# EAGLE design dmxisolator-mod-v1a (EAGLE 9.1.2)
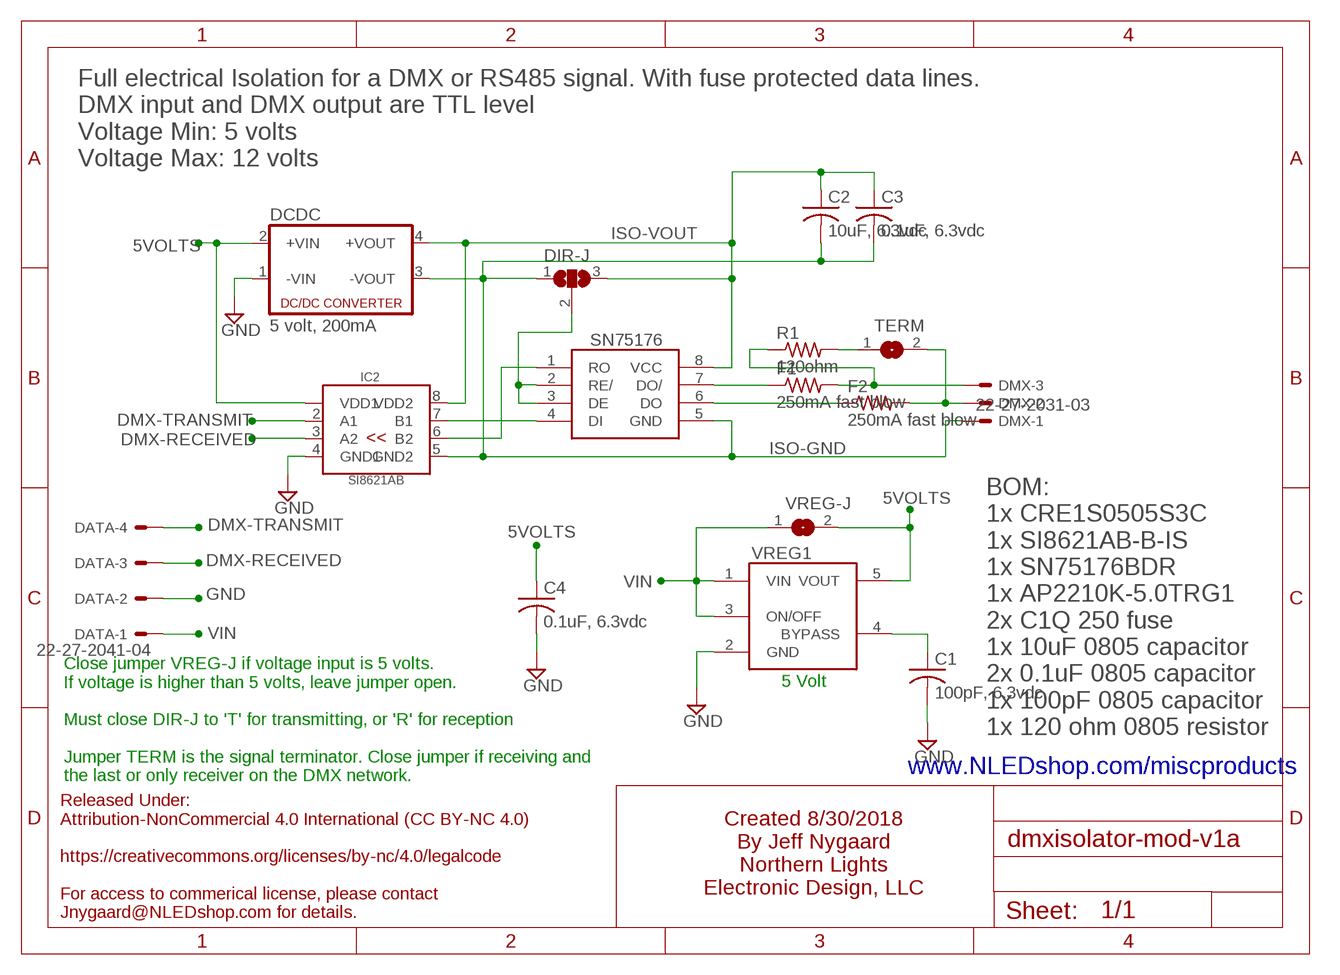
[diagram p0: schematic, sheet 1]

## Parts
C1  100pF, 6.3vdc  C-USC0805  [C0805]
C2  10uF, 6.3vdc  C-USC0805  [C0805]
C3  0.1uF, 6.3vdc  C-USC0805  [C0805]
C4  0.1uF, 6.3vdc  C-USC0805  [C0805]
DATA  22-27-2041-04  [6410-04]
DCDC  5 volt, 200mA  NME  [NME]
DIR-J  SJ2W  [SJ_2]
DMX  22-27-2031-03  [6410-03]
F1  250mA fast blow  R-US_R1206  [R1206]
F2  250mA fast blow  R-US_R1206  [R1206]
IC2  SI8621AB-B-IS  [SOIC-8]
R1  120ohm  R-US_R0805  [R0805]
SN75176  SN75176SMD  [SOIC-8]
TERM  SJ  [SJ]
VREG1  AP2210K  [SOT25]
VREG-J  SJ  [SJ]

## Nets
5VOLTS: C4.1 DCDC.2(+VIN) IC2.1(VDD1) VREG1.5(VOUT) VREG-J.2
BYPASS: C1.1 VREG1.4(BYPASS)
DMX-INV: DMX.3 F1.2 R1.1
DMX-POS: DMX.2 F2.2 TERM.2
DMX-RECEIVED: DATA.3 IC2.3(A2)
DMX-TRANSMIT: DATA.4 IC2.2(A1)
GND [ground]: C1.2 C4.2 DATA.2 DCDC.1(-VIN) IC2.4(GND1) VREG1.2(GND)
ISO-GND: C2.2 C3.2 DCDC.3(-VOUT) DIR-J.1 DMX.1 IC2.5(GND2) SN75176.5(GND)
ISO-VOUT: C2.1 C3.1 DCDC.4(+VOUT) DIR-J.3 IC2.8(VDD2) SN75176.8(VCC)
N$1: R1.2 TERM.1
N$2: F1.1 SN75176.7(DO/)
N$4: F2.1 SN75176.6(DO)
N$9: DIR-J.2 SN75176.2(RE/) SN75176.3(DE)
N$10: IC2.6(B2) SN75176.1(RO)
N$11: IC2.7(B1) SN75176.4(DI)
VIN: DATA.1 VREG1.1(VIN) VREG1.3(ON/OFF) VREG-J.1

## Notes on the sheet
- Full electrical Isolation for a DMX or RS485 signal. With fuse protected data lines.
  DMX input and DMX output are TTL level
  Voltage Min: 5 volts
  Voltage Max: 12 volts
- 5 Volt
- BOM:
  1x CRE1S0505S3C 
  1x SI8621AB-B-IS 
  1x SN75176BDR 
  1x AP2210K-5.0TRG1 
  2x C1Q 250 fuse
  1x 10uF 0805 capacitor
  2x 0.1uF 0805 capacitor
  1x 100pF 0805 capacitor
  1x 120 ohm 0805 resistor
- www.NLEDshop.com/miscproducts
- Close jumper VREG-J if voltage input is 5 volts.
  If voltage is higher than 5 volts, leave jumper open.
  
  Must close DIR-J to 'T' for transmitting, or 'R' for reception
  
  Jumper TERM is the signal terminator. Close jumper if receiving and
  the last or only receiver on the DMX network.
- Created 8/30/2018
  By Jeff Nygaard
  Northern Lights
  Electronic Design, LLC
- Released Under:
  Attribution-NonCommercial 4.0 International (CC BY-NC 4.0)
  
  https://creativecommons.org/licenses/by-nc/4.0/legalcode
  
  For access to commerical license, please contact
  Jnygaard@NLEDshop.com for details.

## Library data of the parts
C1-C4 = rcl:C-US: CAPACITOR, American symbol; SPICEPREFIX: C
DATA = con-molex:22-?-04: CONNECTOR wire to board 2.54 mm (.1 inch) pitch header; MF: MOLEX; OC_FARNELL: unknown; OC_NEWARK: unknown
DCDC = dc-dc-converter:NME: DC-DC CONVERTER; MF: C & D TECHNOLOGIES, INC; MPN: NME1205D; OC_FARNELL: 1021466; OC_NEWARK: 98B8198
DIR-J = jumper:SJ2W: SMD solder JUMPER
DMX = con-molex:22-?-03: CONNECTOR wire to board 2.54 mm (.1 inch) pitch header; MF: MOLEX; OC_FARNELL: unknown; OC_NEWARK: unknown
F1 F2 R1 = rcl:R-US_: RESISTOR, American symbol; SPICEPREFIX: R
IC2 = NLED-integratedcircuit:SI8621AB-B-IS
SN75176 = NLED-integratedcircuit:SN75176
TERM VREG-J = jumper:SJ: SMD solder JUMPER
VREG1 = NLED-integratedcircuit:AP2210K: AP2210K - Diodes Incorporated LDO Voltage Regulators 300mA CMOS LDO 5.0V 250mV

## Board
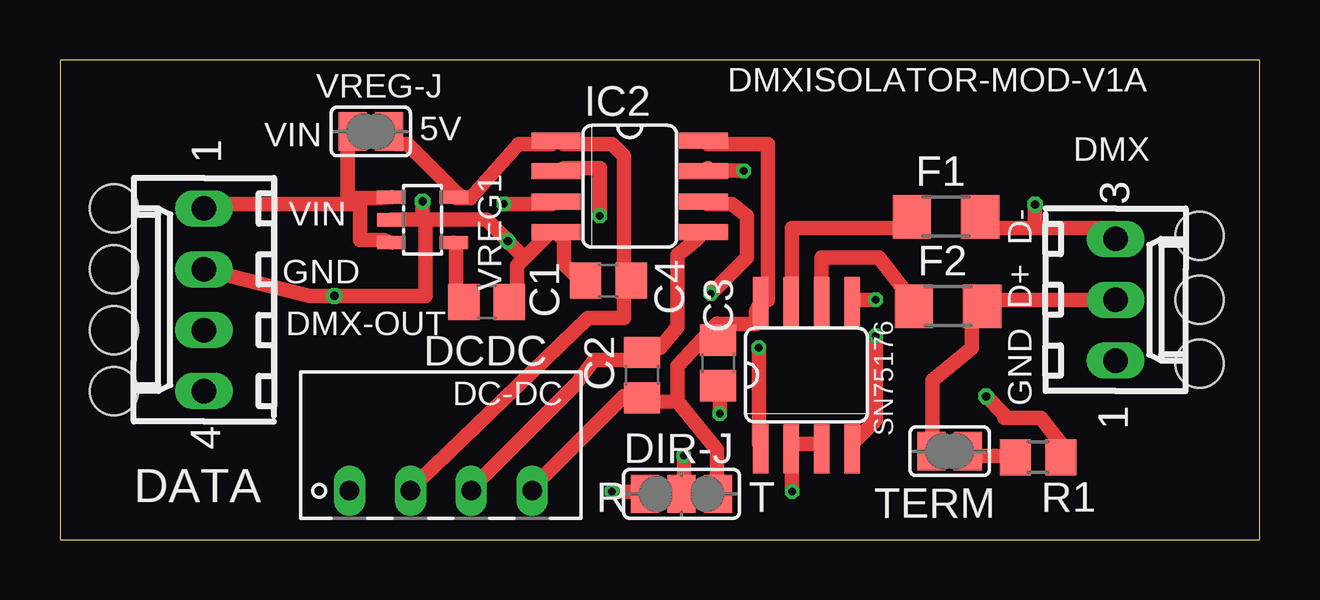
[diagram p1: board, top side]
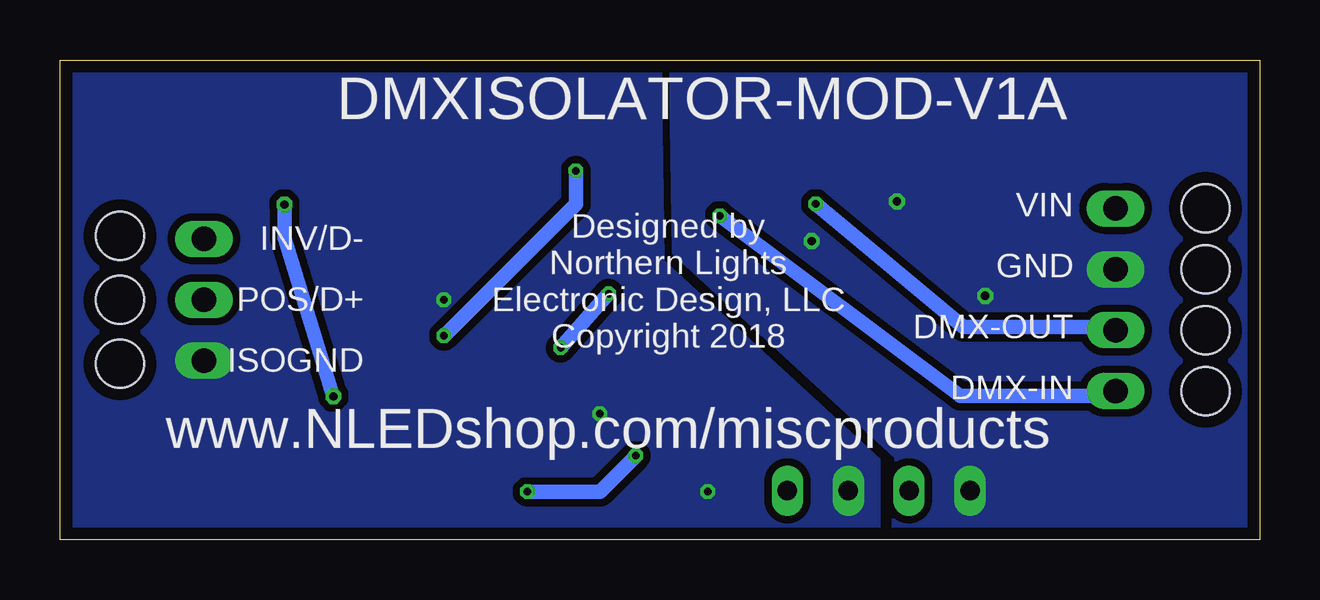
[diagram p2: board, bottom side, seen from below]

Size 50 x 20 mm. Coordinates in mm from the lower left corner, seen from the top.
Outline: 0,0 50,0 50,20 0,20 0,0
Copper layers (1*16): Top 0.035mm / dielectric 1.5mm / Bottom 0.035mm
Design rules "SeeedStudio_2layer_DRU_no_angle_20140221 *": minimum track width 12mil, minimum drill 12mil, track to track 12mil, track to pad 20mil, pad to pad 6mil, via to via 6mil, smd to smd 0mil, copper to edge 20mil, drill to drill 20mil, minimum pad ring 10mil, minimum via ring 6mil, stop-mask expansion 2mil, vias tented up to drill 100mil, thermal gap 10mil
Holes 2 mm at 2.25,6.19 2.25,8.73 2.25,11.27 2.25,13.81 47.5,12.67 47.5,10 47.5,7.33

### Footprints (pad centres in the part's own frame; a part is rotated, then mirrored left to right if it is on the bottom)
C0805 = smd 1.3 x 1.5: 1 -0.95,0; 2 0.95,0
6410-04 = drill 1.016 long: 1 3.81,0; 2 1.27,0; 3 -1.27,0; 4 -3.81,0
NME = drill 0.813 long: 1 0,3.81; 2 0,1.27; 3 0,-1.27; 4 0,-3.81
SJ_2 = smd 1.168 x 1.6: 1 -1.524,0; 2 0,0; 3 1.524,0
6410-03 = drill 1.016 long: 1 2.54,0; 2 0,0; 3 -2.54,0
R1206 = smd 1.6 x 1.803: 1 -1.422,0; 2 1.422,0
SOIC-8 = smd 0.66 x 2.032: 1 -1.905,-3.073; 2 -0.635,-3.073; 3 0.635,-3.073; 4 1.905,-3.073; 5 1.905,3.073; 6 0.635,3.073; 7 -0.635,3.073; 8 -1.905,3.073
R0805 = smd 1.3 x 1.5: 1 -0.95,0; 2 0.95,0
SJ = smd 1.168 x 1.6: 1 -0.762,0; 2 0.762,0
SOT25 = smd 0.55 x 1.2: 1 -0.95,-1.3; 2 0,-1.3; 3 0.95,-1.3; 4 0.95,1.3; 5 -0.95,1.3

### Placement (x,y rotation side)
C1  17.78,9.91 0 top
C2  24.26,6.86 90 top
C3  27.43,7.37 270 top
C4  22.86,10.79 180 top
DATA  6,10 90 top
DCDC  15.88,2.03 90 top
DIR-J  25.91,1.91 0 top
DMX  44,10 270 top
F1  36.93,13.46 0 top
F2  37.02,9.73 0 top
IC2  23.75,14.73 270 top
R1  40.77,3.43 180 top
SN75176  31.11,6.86 0 top
TERM  37.08,3.68 180 top
VREG1  15.11,13.34 270 top
VREG-J  12.95,17.02 0 top

### Tracks (layer width: path | path; a pad name or v marks a point on that pad's centre or on a via)
5VOLTS
  Top 0.61: VREG-J.2 14,17 14,16.5 14.49,16.5 16.51,14.48 16.64,14.37 VREG1.5 16.5,14.25 17.12,14.25 19.12,16.5 20.5,16.5 IC2.1 21,16.5 23,16.5 23.5,16 23.5,11 C4.1 23.5,10.5 23.5,9.25 22,9.25 15,2.5 DCDC.2
BYPASS
  Top 0.61: VREG1.4 16.5,12.37 16.5,10 C1.1
DMX-INV  (via drill 0.35)
  Top 0.61: 38,13 F1.2 38.5,13 40.64,13 | 40.64,13 44,13 DMX.3 | v40.64,13.97 40.64,13 | R1.1 41.72,4 40.89,5.08 39.37,5.08 39.37,5.21 v38.61,5.97
  Bottom 0.61: v38.61,5.97 40.64,12.57 v40.64,13.97
DMX-POS
  Top 0.61: TERM.2 36.37,4.13 36.37,6.63 38,8 38,9.5 F2.2 38.5,10 DMX.2
DMX-RECEIVED  (via drill 0.3)
  Top 0.61: v18.5,14 20.5,14 IC2.3
  Bottom 0.61: v18.5,14 12.35,8.87 6.87,8.87 6.74,8.73 DATA.3
DMX-TRANSMIT  (via drill 0.3)
  Top 0.61: v22.5,13.5 22.5,15.5 21,15.5 IC2.2
  Bottom 0.61: v22.5,13.5 12.46,6 6,6 DATA.4
GND  (via drill 0.35)
  Top 0.61: C4.2 21.5,11 21.33,11.17 21,11.5 21,12.5 IC2.4 20.45,12.83 19.37,11.75 | C1.2 19.05,10.48 19.05,11.43 19.37,11.75 | VREG1.2 15.24,13.34 | 15.24,13.34 17.78,13.34 19.37,11.75 | DATA.2 10.41,10.16 v11.43,10.16 15.24,10.16 15.24,13.34 | v15.11,14.1 15.11,13.46 15.24,13.34
  other vias: 18.67,12.45
  pour Bottom (no thermals): 0,20.07 0,0 15.24,0.13 15.11,3.43 24.38,11.94 24.51,20.07
ISO-GND  (via drill 0.3)
  Top 0.61: IC2.5 26.5,12.5 25.75,11.87 25.75,8.87 25,8 C2.2 24.5,7.5 22.26,7.5 21.5,6.5 17.5,2.5 DCDC.3 | v27.5,5.25 27.5,6.5 C3.2 | v23,2 24,2 DIR-J.1 | v34,10 33,10 SN75176.5
  pour Bottom (rank 2, no thermals): 15.89,0 15.89,20 50,20 50,0
ISO-VOUT
  Top 0.61: IC2.8 27,16.5 29.5,16.5 29.5,10 SN75176.8 29,9.5 29,9 27.5,9 C3.1 27.38,9.01 25.75,7.25 25.75,5.76 | 25.75,5.76 27.38,3.75 27.38,2 DIR-J.3 | 25.75,5.76 24.49,5.75 C2.1 24.5,6 23.5,6 20,2.5 DCDC.4
N$1
  Top 0.61: R1.2 39,3.5 38,3.5 TERM.1
N$2
  Top 0.61: F1.1 35.5,13 30.5,13 30.5,10 SN75176.7
N$4
  Top 0.61: F2.1 35.5,10 34.13,11.75 31.75,11.75 31.75,10 SN75176.6
N$9  (via drill 0.3)
  Top 0.61: v26,3.5 26,2 DIR-J.2 | v30.52,2 30.5,3 30.5,3.5 SN75176.2 30.5,4 31.5,4 SN75176.3
  Bottom 0.61: v26,3.5 27.5,2 v30.52,2
N$10  (via drill 0.3)
  Top 0.61: v29.13,8 29.13,4 SN75176.1 | v27.13,10.25 28.63,11.75 28.63,13.5 28,14 27,14 IC2.6
  Bottom 0.61: v27.13,10.25 v29.13,8
N$11  (via drill 0.3)
  Top 0.61: v34,8.5 34,5 33,4 SN75176.4 | v28.5,15.38 27,15.38 27,15.5 IC2.7
  Bottom 0.61: v34,8.5 28.5,14 v28.5,15.38
VIN
  Top 0.61: 11.99,14.25 11.99,17 VREG-J.1 | 11.99,14.25 12.5,14 | 12.5,14 12.5,12.5 13.5,12.5 VREG1.3 | 11.99,14.25 13.37,14.25 VREG1.1 | 12.5,14 6,14 DATA.1

### Text on the board
tNames: DMXISOLATOR-MOD-V1A | VIN | 5V | VIN | GND | DMX-OUT | GND D+ D- | R | T
bNames: DMXISOLATOR-MOD-V1A | Designed by / Northern Lights / Electronic Design, LLC / Copyright 2018 | INV/D- / POS/D+ / ISOGND | VIN / GND / DMX-OUT / DMX-IN | www.NLEDshop.com/miscproducts